# Altium project PCB V1.PrjPcb
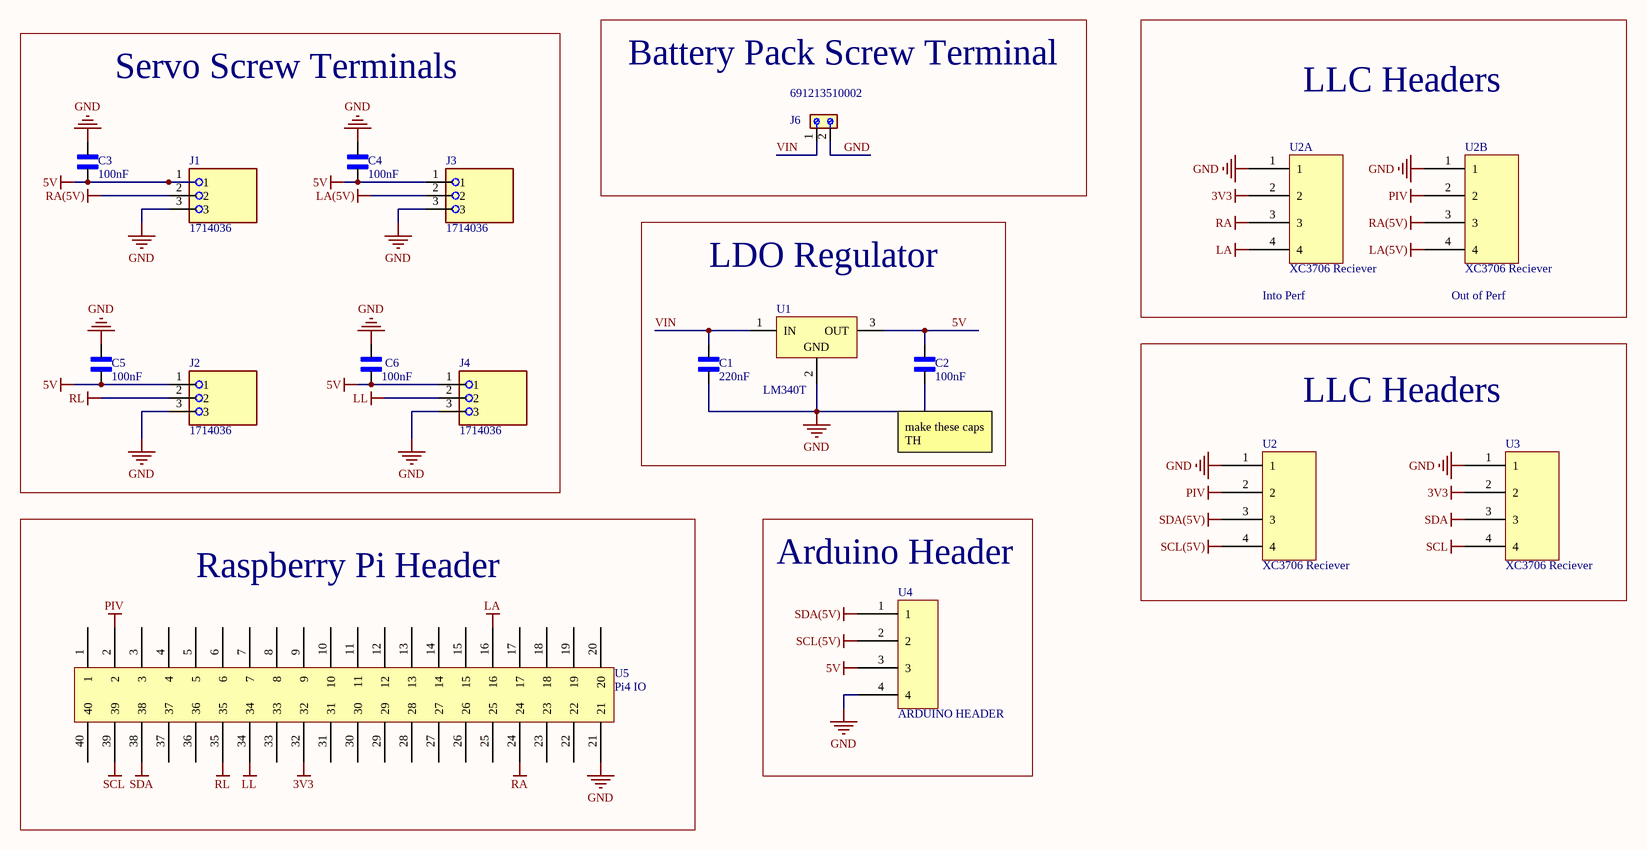
[diagram p0: Sheet1.SchDoc]
1 sheet, 18 parts. Net scope: global (net labels, ports and power ports of the same name join across sheets).
Board file: PCB1.PcbDoc

## Sheet Sheet1.SchDoc
size A3; SheetNumber: 1; SheetTotal: 1

### Parts
C1  value 220nF  [CAPRR508W50L508T317H508]  (hidden comment: SR215E224MARTR)
C2  value 100nF  [CAPRR254W50L508T317H508]  (hidden comment: SR201E104MARTR)
C3  value 100nF  [CAPRR254W50L508T317H508]  (hidden comment: SR201E104MARTR)
C4  value 100nF  [CAPRR254W50L508T317H508]  (hidden comment: SR201E104MARTR)
C5  value 100nF  [CAPRR254W50L508T317H508]  (hidden comment: SR201E104MARTR)
C6  value 100nF  [CAPRR254W50L508T317H508]  (hidden comment: SR201E104MARTR)
J1  1714036  [PHOENIX_1714036]
J2  1714036  [PHOENIX_1714036]
J3  1714036  [PHOENIX_1714036]
J4  1714036  [PHOENIX_1714036]
J6  691213510002  [691213510002]
U1  LM340T  [NDE0003A]
U2  XC3706 Reciever  [XC3706 Reciever]
U2A  XC3706 Reciever  [XC3706 Reciever]
U2B  XC3706 Reciever  [XC3706 Reciever]
U3  XC3706 Reciever  [XC3706 Reciever]
U4  ARDUINO HEADER  [ARDUINO HEADER]
U5  Pi4 IO  [PI4 GPIO]

### Blocks framed on the sheet
Servo Screw Terminals: C3-C6 J1-J4
Battery Pack Screw Terminal: J6
LLC Headers: U2A U2B
LDO Regulator: C1 C2 U1
LLC Headers: U2 U3
Raspberry Pi Header: U5
Arduino Header: U4

### Nets
3V3: U2A.2 U3.2 U5.32
5V: C2.1 C3.2 C4.2 C5.2 C6.2 J1.1 J2.1 J3.1 J4.1 U1.3(OUT) U4.3
GND: C1.1 C2.2 C3.1 C4.1 C5.1 C6.1 J1.3 J2.3 J3.3 J4.3 J6.2 U1.2(GND) U2.1 U2A.1 U2B.1 U3.1 U4.4 U5.21
LA: U2A.4 U5.16
LA(5V): J3.2 U2B.4
LL: J4.2 U5.34
PIV: U2.2 U2B.2 U5.2
RA: U2A.3 U5.24
RA(5V): J1.2 U2B.3
RL: J2.2 U5.35
SCL: U3.4 U5.39
SCL(5V): U2.4 U4.2
SDA: U3.3 U5.38
SDA(5V): U2.3 U4.1
VIN: C1.2 J6.1 U1.1(IN)

Not connected (* = marked no-connect by the designer): U5 1 3 4 5 6 7 8 9 10 11 12 13 14 15 17 18 19 20 22 23 25 26 27 28 29 30 31 33 36 37 40

### Notes on the sheet
- (near U2A) Into Perf
- (near U2B) Out of Perf
- (near C2) make these caps TH

### Library data of the parts
C1 = CMP-001-00086-1: SR 220nF Ceramic Multilayer Cap,50V dc,+85C,Z5U Dielectric,+/-20%,Through Hole; MF: KYOCERA AVX; Source: SR215E224MARTR.SchLib; MP: SR215E224MARTR; Case/Package: Radial AVX; Pins: 2; Design Item ID: SR215E224MARTR; SnapEDA_Link: https://www.snapeda.com/parts/SR215E224MARTR/Kyocera/view-part/?ref=snap; Component Type: Standard; Check_prices: https://www.snapeda.com/parts/SR215E224MARTR/Kyocera/view-part/?ref=eda
C2-C6 = CMP-001-00087-1: SR 100nF Ceramic Multilayer Cap,100V dc,+85C,Z5U Dielectric,+/-20%,Through Hole; MF: KYOCERA AVX; Pins: 2; Check_prices: https://www.snapeda.com/parts/SR201E104MARTR/Kyocera/view-part/?ref=eda; MP: SR201E104MARTR; Source: SR201E104MARTR.SchLib; Component Type: Standard; Case/Package: None; Design Item ID: SR201E104MARTR; SnapEDA_Link: https://www.snapeda.com/parts/SR201E104MARTR/Kyocera/view-part/?ref=snap
J1-J4 = CMP-014-000001-1: PCB Terminal Screw 5mm 12AWG 400V 24A 3 Position COMBICON MKDSP Series; MF: Phoenix Contact; Check_prices: https://www.snapeda.com/parts/1714036/Phoenix+Contact/view-part/?ref=eda; Package: None; MP: 1714036; Design Item ID: 1714036; Value: *; Source: 1714036.SchLib; Component Type: Standard; Pin Count: 3; SnapEDA_Link: https://www.snapeda.com/parts/1714036/Phoenix+Contact/view-part/?ref=snap
J6 = CMP-014-000000-1: 2 Position Wire to Board Terminal Block Horizontal with Board 0.200 (5.08mm) Through Hole; MF: WÃ¼rth Elektronik; Pin Count: 2; Value: *; SnapEDA_Link: https://www.snapeda.com/parts/691213510002/W%25C3%25BCrth+Elektronik+Midcom/view-part/?ref=snap; Package: None; Check_prices: https://www.snapeda.com/parts/691213510002/W%25C3%25BCrth+Elektronik+Midcom/view-part/?ref=eda; Component Type: Standard; Design Item ID: 691213510002; MP: 691213510002; Source: 691213510002.SchLib
U1 = CMP-019-00049-1: Pwr Sply Func, Voltage Regulator, Positive Voltage Out, TO-220, IS 6mA, VO 5V, Vn 40uV; Max Supply Voltage: 35V; Output Current: 1A; Dropout Voltage: 2V; Pins: 3; Mounting Technology: Through Hole; Max Operating Temperature: 125°C; Case/Package: TO-220; Output Voltage: 5V; Min Operating Temperature: 0°C